# EAGLE schematic rpi_extension (EAGLE 7.2.0)
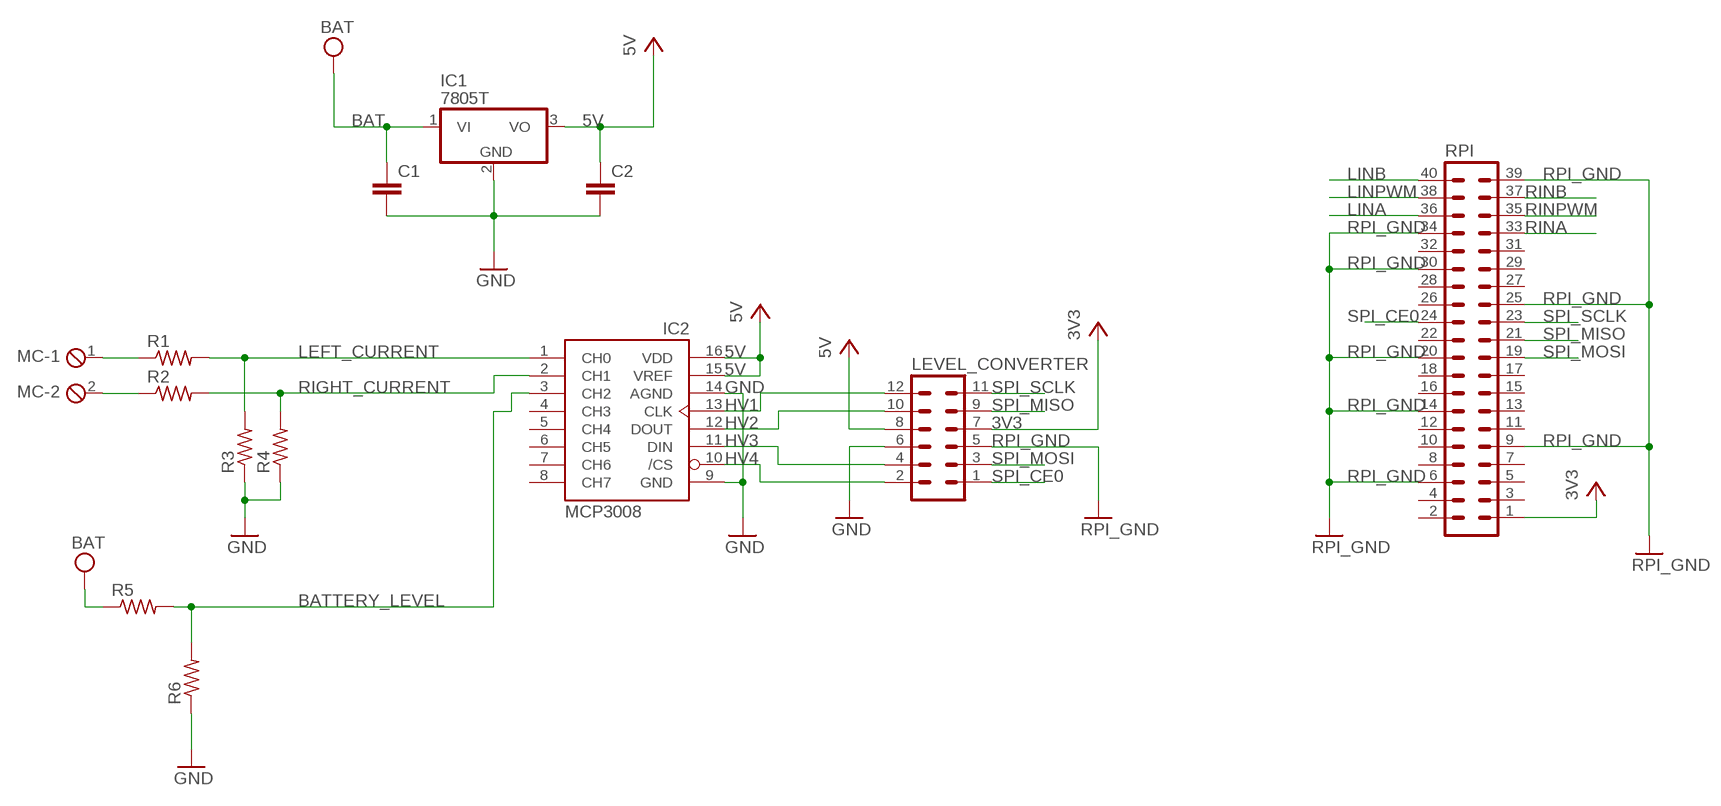
[diagram p0: schematic, sheet 1]

## Parts
C1  C2,5-3  [C2.5-3]
C2  C2,5-3  [C2.5-3]
IC1  7805T  [TO220H]
IC2  MCP3008  [DIL16]
LEVEL_CONVERTER  MA06-2  [MA06-2]
MC  MPT2  [2POL254]
R1  R-US_0204/2V  [0204V]
R2  R-US_0204/2V  [0204V]
R3  R-US_0204/2V  [0204V]
R4  R-US_0204/2V  [0204V]
R5  R-US_0204/2V  [0204V]
R6  R-US_0204/2V  [0204V]
RPI  MA20-2  [MA20-2]

## Nets
3V3: LEVEL_CONVERTER.7
5V: C2.1 IC1.3(VO) IC2.15(VREF) IC2.16(VDD) LEVEL_CONVERTER.8
BAT: C1.1 IC1.1(VI)
BATTERY_LEVEL: IC2.3(CH2) R5.2 R6.2
GND: C1.2 C2.2 IC1.2(GND) IC2.9(GND) IC2.14(AGND) LEVEL_CONVERTER.6 R3.1 R4.1 R6.1
HV1: IC2.13(CLK) LEVEL_CONVERTER.12
HV2: IC2.12(DOUT) LEVEL_CONVERTER.10
HV3: IC2.11(DIN) LEVEL_CONVERTER.4
HV4: IC2.10(/CS) LEVEL_CONVERTER.2
LEFT_CURRENT: IC2.1(CH0) R1.2 R3.2
LINA: RPI.36
LINB: RPI.40
LINPWM: RPI.38
N$1: MC.2 R2.1
N$2: MC.1 R1.1
RIGHT_CURRENT: IC2.2(CH1) R2.2 R4.2
RINA: RPI.33
RINB: RPI.37
RINPWM: RPI.35
RPI_GND: LEVEL_CONVERTER.5 RPI.6 RPI.9 RPI.14 RPI.20 RPI.25 RPI.30 RPI.34 RPI.39
SPI_CE0: LEVEL_CONVERTER.1 RPI.24
SPI_MISO: LEVEL_CONVERTER.9 RPI.21
SPI_MOSI: LEVEL_CONVERTER.3 RPI.19
SPI_SCLK: LEVEL_CONVERTER.11 RPI.23
VCC: R5.1 RPI.1 ; supply symbol labelled 3V3, BAT
Unconnected: IC2.4(CH3) IC2.5(CH4) IC2.6(CH5) IC2.7(CH6) IC2.8(CH7) RPI.2 RPI.3 RPI.4 RPI.5 RPI.7 RPI.8 RPI.10 RPI.11 RPI.12 RPI.13 RPI.15 RPI.16 RPI.17 RPI.18 RPI.22 RPI.26 RPI.27 RPI.28 RPI.29 RPI.31 RPI.32

## Library data of the parts
C1 C2 = capacitor-wima:C: CAPACITOR naming: grid - package width
IC1 = linear:78*: Positive VOLTAGE REGULATOR Source: http://cache.national.com/ds/LM/LM78L05.pdf http://www.fairchildsemi.com/ds/LM/LM7805.pdf
IC2 = adafruit:MCP3008
LEVEL_CONVERTER = con-lstb:MA06-2: PIN HEADER; OC_FARNELL: unknown; OC_NEWARK: unknown
MC = con-phoenix-254:MPT2: PHOENIX CONNECTOR; OC_FARNELL: unknown; OC_NEWARK: unknown
R1-R6 = adafruit:R-US_: RESISTOR, American symbol
RPI = con-lstb:MA20-2: PIN HEADER; OC_FARNELL: unknown; OC_NEWARK: unknown